# EAGLE design clap_switch_smd (EAGLE 8.3.2)
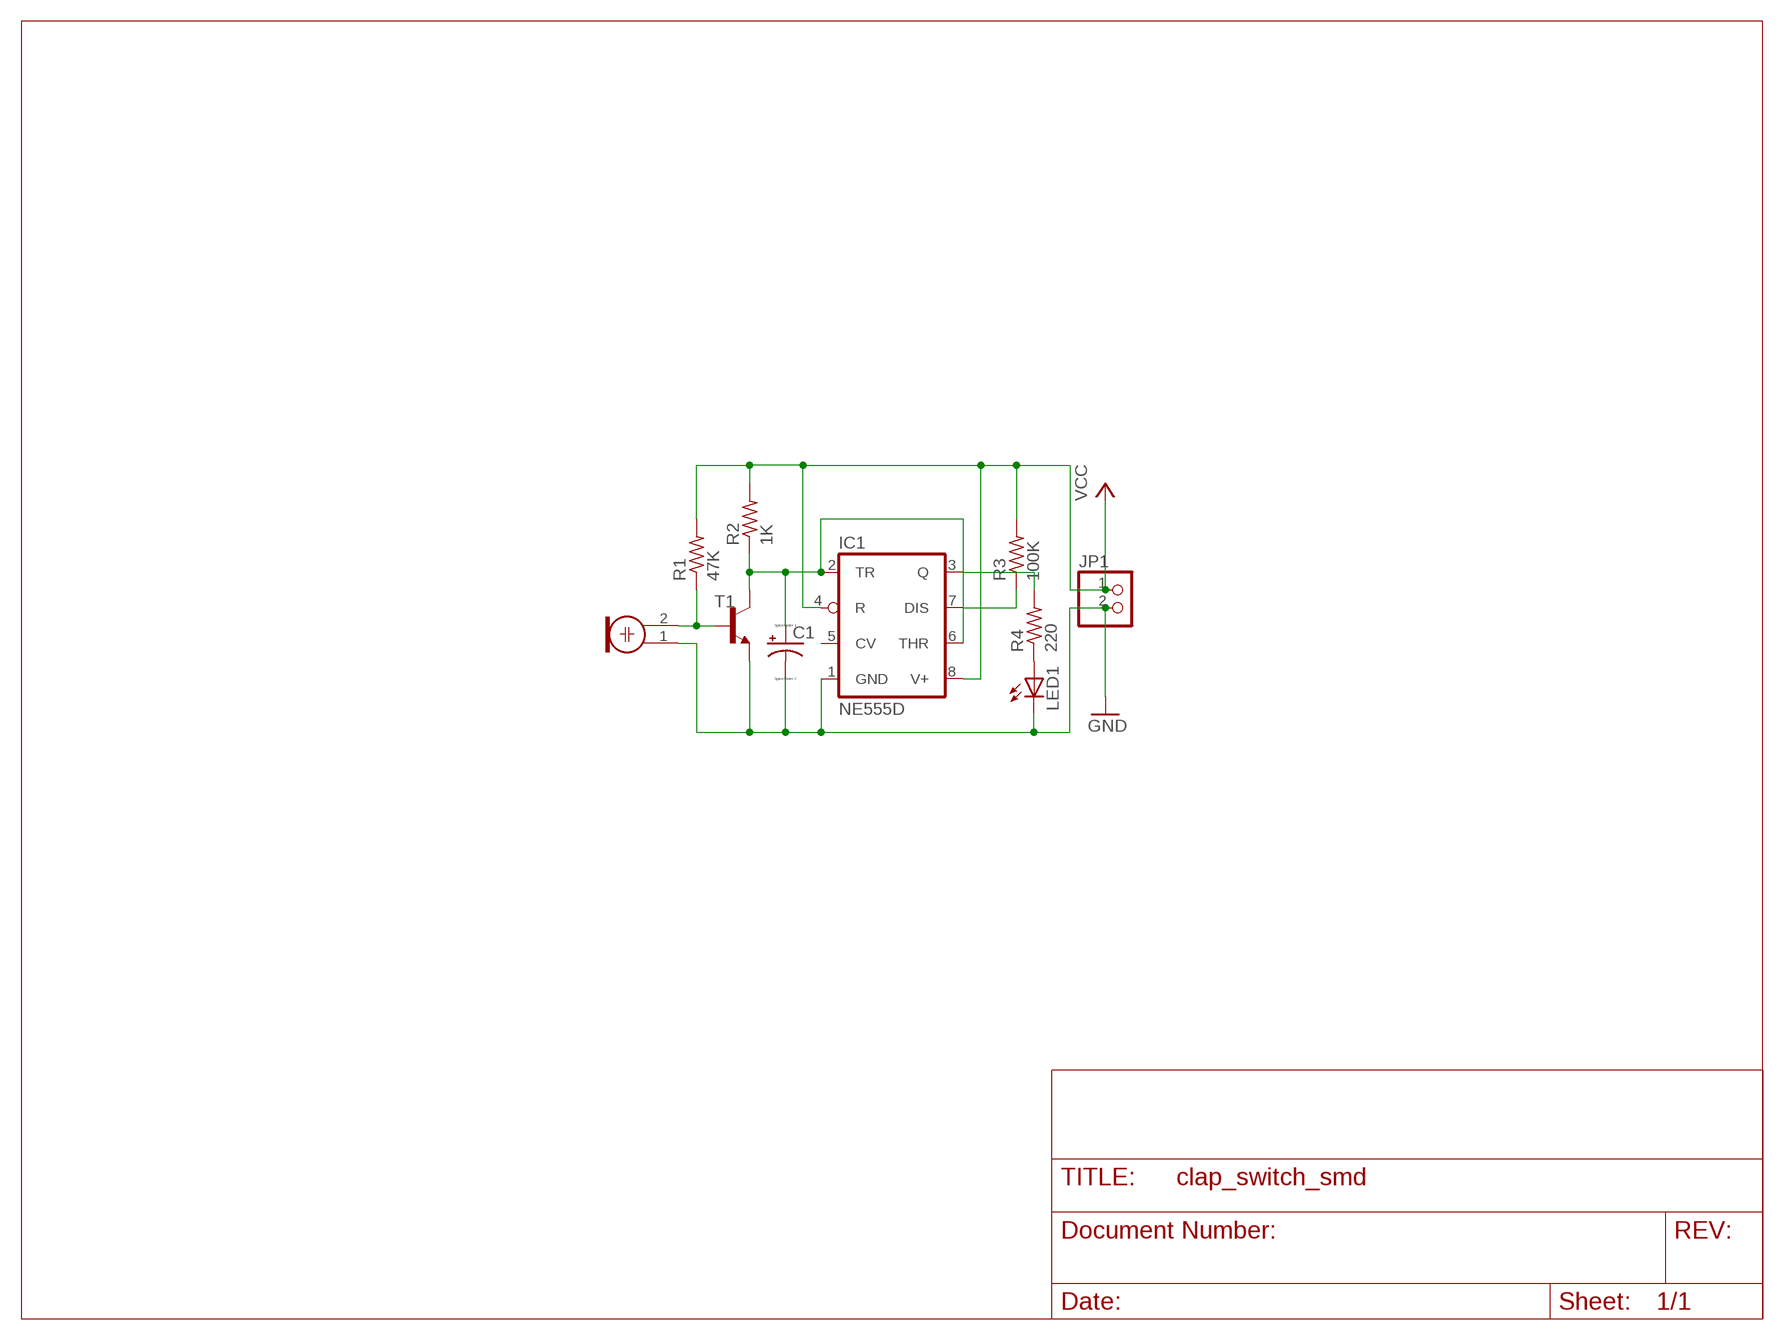
[diagram p0: schematic, sheet 1]

## Parts
C1  CPOL-US153CLV-0405  [153CLV-0405]
IC1  NE555D  [SO08]
JP1  PINHD-1X2  [1X02]
LED1  LEDCHIP-LED0603  [CHIP-LED0603]
M1  MIC  ELECTRET_MICROPHON-WM-61A  [WM-61A]
R1  47K  R-US_R0603  [R0603]
R2  1K  R-US_R0603  [R0603]
R3  100K  R-US_R0603  [R0603]
R4  220  R-US_R0603  [R0603]
T1  MMBT3904LT1-NPN-SOT23-BEC  [SOT23-BEC]

## Nets
GND: C1.- IC1.1(GND) JP1.2 LED1.C M1.1 T1.E
N$1: M1.2 R1.1 T1.B
N$2: C1.+ IC1.2(TR) IC1.6(THR) R2.1 T1.C
N$6: IC1.7(DIS) R3.1
N$7: LED1.A R4.1
N$8: IC1.3(Q) R4.2
VCC: IC1.4(R) IC1.8(V+) JP1.1 R1.2 R2.2 R3.2
Unconnected: IC1.5(CV)

## Library data of the parts
C1 = resistor:CPOL-US: POLARIZED CAPACITOR, American symbol
IC1 = linear:*555: TIMER
JP1 = pinhead:PINHD-1X2: PIN HEADER
LED1 = led:LED: LED OSRAM: - CHIPLED LG R971, LG N971, LY N971, LG Q971, LY Q971, LO R971, LY R971 LH N974, LH R974 LS Q976, LO Q976, LY Q976 LO Q996 - Hyper CHIPLED LW Q18S LB Q993, LB Q99A, LB R99A - SideLED LS A670, LO A670, LY A670, LG A670, LP A670 LB A673, LV A673, LT A673, LW A673 LH A674 LY A675 LS A676, LA A676, LO A676, LY A676, LW A676 LS A679, LY A679, LG A679 - Hyper Micro SIDELED® LS Y876, LA Y876, LO Y876, LY Y876 LT Y87S - SmartLED LW L88C, LW L88S LB L89C, LB L89S, LG L890 LS L89K, LO L89K, LY L89K LS L896, LA L896, LO L896, LY L896 - TOPLED LS T670, LO T670, LY T670, LG T670, LP T670 LSG T670, LSP T670, LSY T670, LOP T670, LYG T670 LG T671, LOG T671, LSG T671 LB T673, LV T673, LT T673, LW T673 LH T674 LS T676, LA T676, LO T676, LY T676, LB T676, LH T676, LSB T676, LW T676 LB T67C, LV T67C, LT T67C, LS T67K, LO T67K, LY T67K, LW E67C LS E67B, LA E67B, LO E67B, LY E67B, LB E67C, LV E67C, LT E67C LW T67C LS T679, LY T679, LG T679 LS T770, LO T770, LY T770, LG T770, LP T770 LB T773, LV T773, LT T773, LW T773 LH T774 LS E675, LA E675, LY E675, LS T675 LS T776, LA T776, LO T776, LY T776, LB T776 LHGB T686 LT T68C, LB T68C - Hyper Mini TOPLED® LB M676 - Mini TOPLED Santana® LG M470 LS M47K, LO M47K, LY M47K Source: http://www.osram.convergy.de LUXEON: - LUMILED® LXK2-PW12-R00, LXK2-PW12-S00, LXK2-PW14-U00, LXK2-PW14-V00 LXK2-PM12-R00, LXK2-PM12-S00, LXK2-PM14-U00 LXK2-PE12-Q00, LXK2-PE12-R00, LXK2-PE12-S00, LXK2-PE14-T00, LXK2-PE14-U00 LXK2-PB12-K00, LXK2-PB12-L00, LXK2-PB12-M00, LXK2-PB14-N00, LXK2-PB14-P00, LXK2-PB14-Q00 LXK2-PR12-L00, LXK2-PR12-M00, LXK2-PR14-Q00, LXK2-PR14-R00 LXK2-PD12-Q00, LXK2-PD12-R00, LXK2-PD12-S00 LXK2-PH12-R00, LXK2-PH12-S00 LXK2-PL12-P00, LXK2-PL12-Q00, LXK2-PL12-R00 Source: www.luxeon.com KINGBRIGHT: KA-3528ASYC Source: www.kingbright.com
M1 = microphon:ELECTRET_MICROPHON-: Electret Condenser Microphone
R1-R4 = resistor:R-US_: RESISTOR, American symbol
T1 = transistor:*-NPN-: NPN Transistror BF959 corrected 2008.03.06

## Board
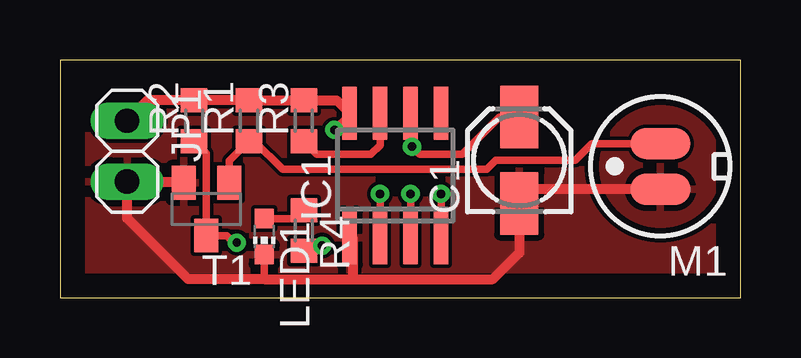
[diagram p1: board, top side]
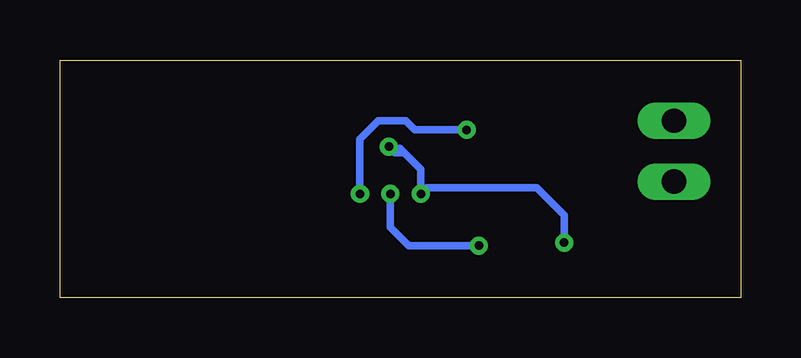
[diagram p2: board, bottom side, seen from below]

Size 28.37 x 9.9 mm. Coordinates in mm from the lower left corner, seen from the top.
Outline: 0,0 28.37,0 28.37,9.9 0,9.9 0,0
Copper layers (1*16): Top 0.035mm / dielectric 1.5mm / Bottom 0.035mm
Design rules "default": minimum track width 6mil, minimum drill 0.35mm, track to track 6mil, track to pad 6mil, pad to pad 6mil, via to via 6mil, smd to smd 6mil, copper to edge 40mil, drill to drill 6mil, minimum pad ring 10mil, minimum via ring 8mil, stop-mask expansion 4mil, vias tented up to drill 0mil, thermal gap 10mil

### Footprints (pad centres in the part's own frame; a part is rotated, then mirrored left to right if it is on the bottom)
153CLV-0405 = smd 2.6 x 1.6: + 1.8,0; - -1.8,0
SO08 = smd 0.6 x 2.2: 1 -1.905,-2.6; 2 -0.635,-2.6; 3 0.635,-2.6; 4 1.905,-2.6; 5 1.905,2.6; 6 0.635,2.6; 7 -0.635,2.6; 8 -1.905,2.6
1X02 = drill 1.016 long: 1 -1.27,0; 2 1.27,0
CHIP-LED0603 = smd 0.8 x 0.8: A 0,-0.75; C 0,0.75
WM-61A = smd 2.5 x 1.3: 1 0,0.95; 2 0,-0.95
R0603 = smd 1 x 1.1: 1 -0.85,0; 2 0.85,0
SOT23-BEC = smd 1 x 1.4: B -0.95,-1.1; C 0,1.1; E 0.95,-1.1

### Placement (x,y rotation side)
C1  19.14,5.71 90 top
IC1  13.97,5.08 0 top
JP1  2.79,6.1 270 top
LED1  8.51,2.54 180 top
M1  25.02,5.46 180 top
R1  7.87,7.37 90 top
R2  5.59,7.37 90 top
R3  10.16,7.37 90 top
R4  10.16,2.79 270 top
T1  6.1,3.68 180 top

### Tracks (layer width: path | path; a pad name or v marks a point on that pad's centre or on a via)
GND
  Top 0.305: LED1.C 8.51,0.76
  Top 0.406: T1.E 5.1,4.83 JP1.2 2.79,3.3 5.33,0.76 8.51,0.76 12.19,0.76 | M1.1 19.73,4.51 C1.- 19.14,1.86 18.03,0.76 12.19,0.76 | IC1.1 12.19,2.48 12.19,0.76
  pour Top: 0.25,9.65 28.19,9.65 28.19,0.25 0.25,0.25
N$1
  Top 0.305: T1.B 7.05,5.69 R1.1 8.09,6.52 9.27,5.33 17.78,5.33 18.16,5.71 21.46,5.71 22.16,6.41 M1.2
N$2  (via drill 0.35)
  Top 0.305: R2.1 6.1,6.01 T1.C 6.94,2.58 7.11,2.41 7.24,2.41 v7.37,2.29 | C1.+ 18.31,7.52 16.76,5.97 14.99,5.97 v14.67,6.29 14.6,6.35 IC1.6 | v13.34,4.32 IC1.2
  Bottom 0.305: v7.37,2.29 7.37,3.43 8.51,4.57 13.08,4.57 v13.34,4.32 13.34,5.33 14.03,6.03 | 14.03,6.03 14.22,6.22 | 14.03,6.03 14.41,6.03 v14.67,6.29
N$6
  Top 0.305: IC1.7 13.34,6.35 12.95,5.97 10.71,5.97 R3.1
N$7
  Top 0.305: LED1.A 10.16,3.29 R4.1
N$8  (via drill 0.35)
  Top 0.305: R4.2 10.71,1.94 10.8,2.03 v10.92,2.16 | v14.6,4.32 IC1.3
  Bottom 0.305: v10.92,2.16 13.84,2.16 14.6,2.92 v14.6,4.32
VCC  (via drill 0.35)
  Top 0.305: IC1.8 12.06,7.62 v11.43,6.98 | IC1.4 v15.88,4.32
  Top 0.406: JP1.1 3.64,8.22 R2.2 R1.2 R3.2 11.53,8.22 IC1.8
  Bottom 0.305: v11.43,6.98 13.59,6.98 13.97,7.37 15.11,7.37 15.88,6.6 v15.88,4.32 | v15.88,4.32 15.88,4.19 v15.88,4.32